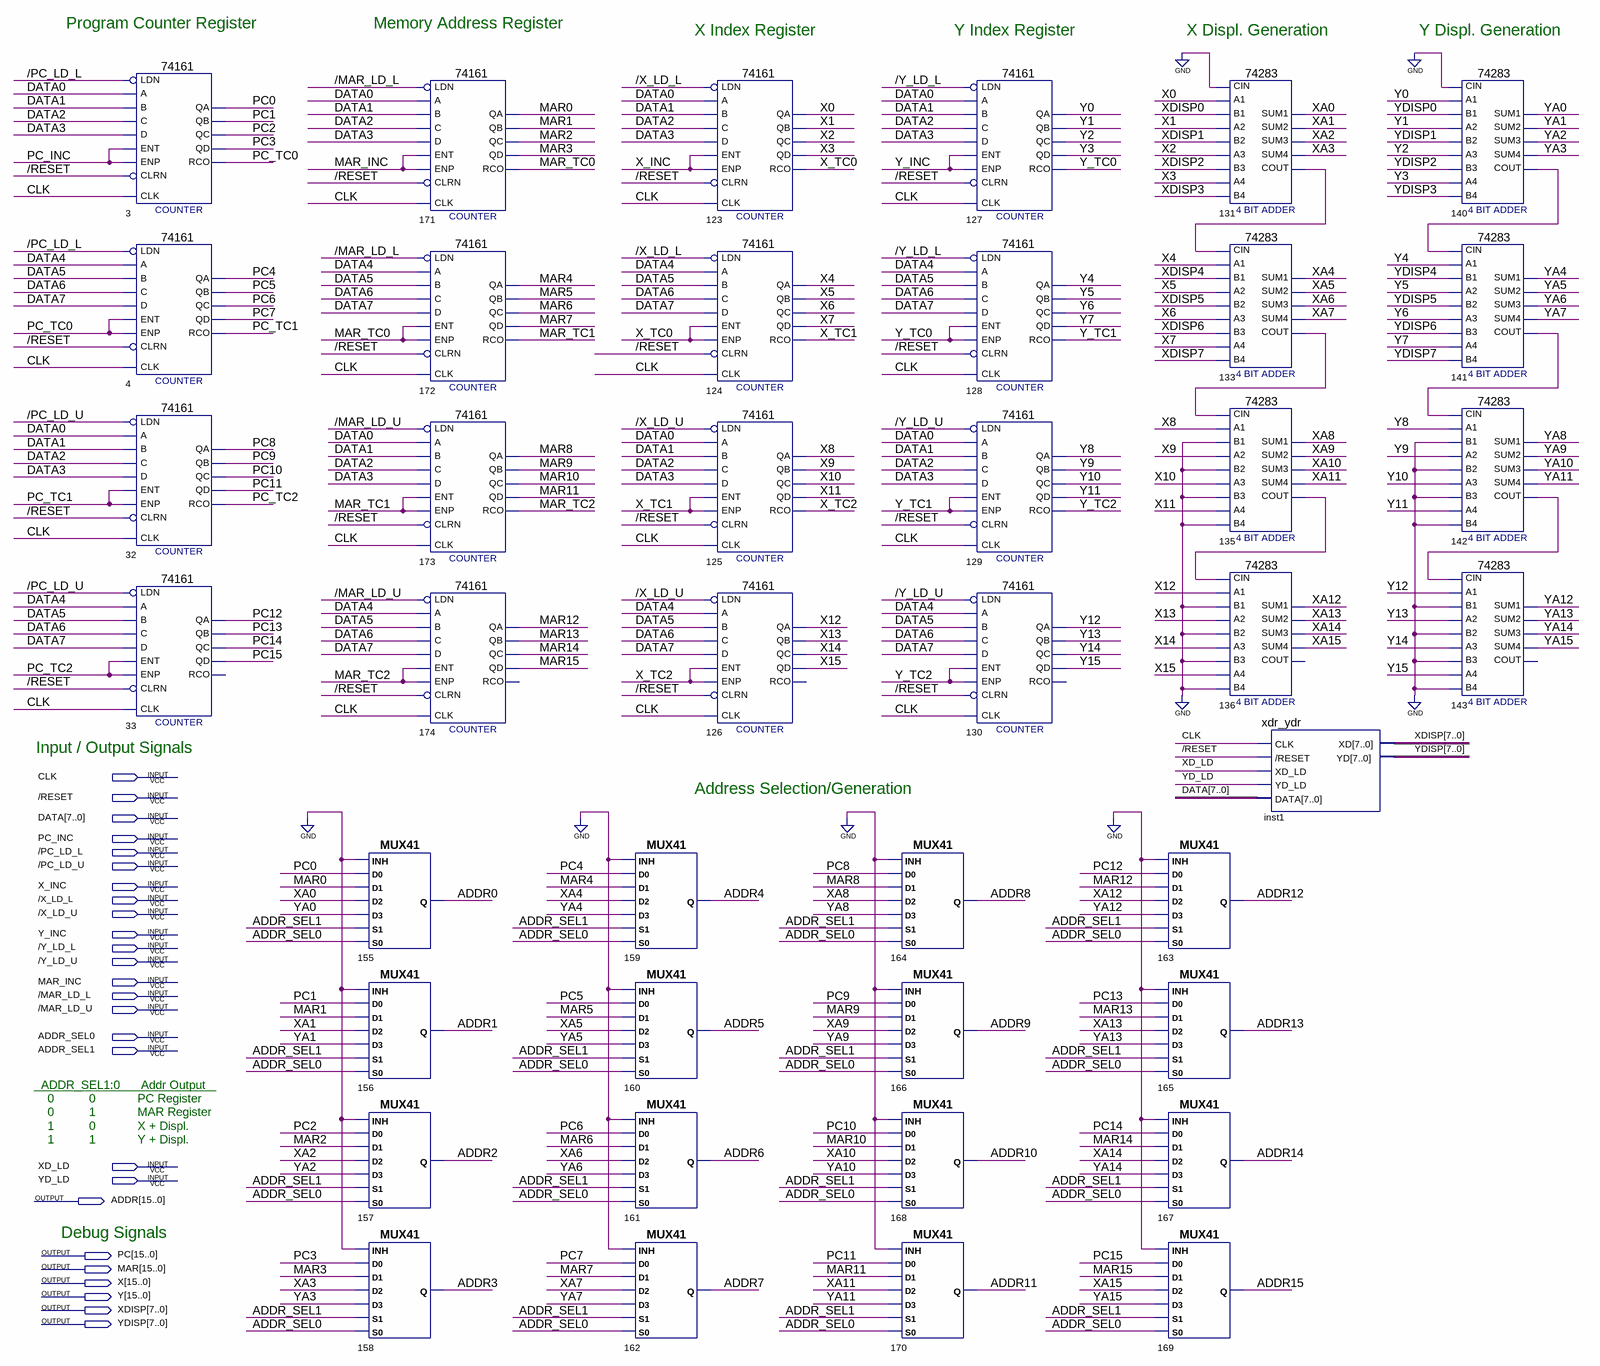
[diagram p0: schematic sheet]
// Quartus schematic pc_mar_ix.bdf as structural Verilog: 41 symbols, 26 pins
module pc_mar_ix (
  input  CLK,
  input  \/RESET ,
  input  [7:0] DATA,
  input  PC_INC,
  input  \/PC_LD_L ,
  input  \/PC_LD_U ,
  input  X_INC,
  input  \/X_LD_L ,
  input  \/X_LD_U ,
  input  Y_INC,
  input  \/Y_LD_L ,
  input  \/Y_LD_U ,
  input  MAR_INC,
  input  \/MAR_LD_L ,
  input  \/MAR_LD_U ,
  input  ADDR_SEL0,
  input  ADDR_SEL1,
  input  XD_LD,
  input  YD_LD,
  output [15:0] ADDR,
  output [15:0] PC,
  output [15:0] MAR,
  output [15:0] X,
  output [15:0] Y,
  output [7:0] XDISP,
  output [7:0] YDISP
);

  wire MAR_TC0, MAR_TC1, MAR_TC2, n131_cout, n133_cout, n135_cout, n140_cout, n141_cout, n142_cout, PC_TC0,
       PC_TC1, PC_TC2, X_TC0, X_TC1, X_TC2, XA0, XA1, XA2, XA3, XA4, XA5, XA6, XA7, XA8, XA9, XA10, XA11,
       XA12, XA13, XA14, XA15, Y_TC0, Y_TC1, Y_TC2, YA0, YA1, YA2, YA3, YA4, YA5, YA6, YA7, YA8, YA9, YA10,
       YA11, YA12, YA13, YA14, YA15;

  \74161  u_3 (
    .CLRN(\/RESET ), .CLK(CLK), .ENP(PC_INC), .LDN(\/PC_LD_L ), .A(DATA[0]), .D(DATA[3]), .ENT(PC_INC),
    .B(DATA[1]), .C(DATA[2]), .QD(PC[3]), .QC(PC[2]), .QB(PC[1]), .QA(PC[0]), .RCO(PC_TC0));
  \74161  u_4 (
    .CLRN(\/RESET ), .CLK(CLK), .ENP(PC_TC0), .LDN(\/PC_LD_L ), .A(DATA[4]), .D(DATA[7]), .ENT(PC_TC0),
    .B(DATA[5]), .C(DATA[6]), .QD(PC[7]), .QC(PC[6]), .QB(PC[5]), .QA(PC[4]), .RCO(PC_TC1));
  \74161  u_32 (
    .CLRN(\/RESET ), .CLK(CLK), .ENP(PC_TC1), .LDN(\/PC_LD_U ), .A(DATA[0]), .D(DATA[3]), .ENT(PC_TC1),
    .B(DATA[1]), .C(DATA[2]), .QD(PC[11]), .QC(PC[10]), .QB(PC[9]), .QA(PC[8]), .RCO(PC_TC2));
  \74161  u_33 (
    .CLRN(\/RESET ), .CLK(CLK), .ENP(PC_TC2), .LDN(\/PC_LD_U ), .A(DATA[4]), .D(DATA[7]), .ENT(PC_TC2),
    .B(DATA[5]), .C(DATA[6]), .QD(PC[15]), .QC(PC[14]), .QB(PC[13]), .QA(PC[12]));  // open: RCO
  MUX41 u_155 (.S0(ADDR_SEL0), .D2(XA0), .S1(ADDR_SEL1), .D3(YA0), .D0(PC[0]), .INH(1'b0), .D1(MAR[0]), .Q(ADDR[0]));
  MUX41 u_156 (.S0(ADDR_SEL0), .D2(XA1), .S1(ADDR_SEL1), .D3(YA1), .D0(PC[1]), .INH(1'b0), .D1(MAR[1]), .Q(ADDR[1]));
  MUX41 u_157 (.S0(ADDR_SEL0), .D2(XA2), .S1(ADDR_SEL1), .D3(YA2), .D0(PC[2]), .INH(1'b0), .D1(MAR[2]), .Q(ADDR[2]));
  MUX41 u_158 (.S0(ADDR_SEL0), .D2(XA3), .S1(ADDR_SEL1), .D3(YA3), .D0(PC[3]), .INH(1'b0), .D1(MAR[3]), .Q(ADDR[3]));
  \74161  u_171 (
    .CLRN(\/RESET ), .CLK(CLK), .ENP(MAR_INC), .LDN(\/MAR_LD_L ), .A(DATA[0]), .D(DATA[3]), .ENT(MAR_INC),
    .B(DATA[1]), .C(DATA[2]), .QD(MAR[3]), .QC(MAR[2]), .QB(MAR[1]), .QA(MAR[0]), .RCO(MAR_TC0));
  \74161  u_172 (
    .CLRN(\/RESET ), .CLK(CLK), .ENP(MAR_TC0), .LDN(\/MAR_LD_L ), .A(DATA[4]), .D(DATA[7]), .ENT(MAR_TC0),
    .B(DATA[5]), .C(DATA[6]), .QD(MAR[7]), .QC(MAR[6]), .QB(MAR[5]), .QA(MAR[4]), .RCO(MAR_TC1));
  \74161  u_173 (
    .CLRN(\/RESET ), .CLK(CLK), .ENP(MAR_TC1), .LDN(\/MAR_LD_U ), .A(DATA[0]), .D(DATA[3]), .ENT(MAR_TC1),
    .B(DATA[1]), .C(DATA[2]), .QD(MAR[11]), .QC(MAR[10]), .QB(MAR[9]), .QA(MAR[8]), .RCO(MAR_TC2));
  \74161  u_174 (
    .CLRN(\/RESET ), .CLK(CLK), .ENP(MAR_TC2), .LDN(\/MAR_LD_U ), .A(DATA[4]), .D(DATA[7]), .ENT(MAR_TC2),
    .B(DATA[5]), .C(DATA[6]), .QD(MAR[15]), .QC(MAR[14]), .QB(MAR[13]), .QA(MAR[12]));  // open: RCO
  MUX41 u_159 (.S0(ADDR_SEL0), .D2(XA4), .S1(ADDR_SEL1), .D3(YA4), .D0(PC[4]), .INH(1'b0), .D1(MAR[4]), .Q(ADDR[4]));
  MUX41 u_160 (.S0(ADDR_SEL0), .D2(XA5), .S1(ADDR_SEL1), .D3(YA5), .D0(PC[5]), .INH(1'b0), .D1(MAR[5]), .Q(ADDR[5]));
  MUX41 u_161 (.S0(ADDR_SEL0), .D2(XA6), .S1(ADDR_SEL1), .D3(YA6), .D0(PC[6]), .INH(1'b0), .D1(MAR[6]), .Q(ADDR[6]));
  MUX41 u_162 (.S0(ADDR_SEL0), .D2(XA7), .S1(ADDR_SEL1), .D3(YA7), .D0(PC[7]), .INH(1'b0), .D1(MAR[7]), .Q(ADDR[7]));
  \74161  u_123 (
    .CLRN(\/RESET ), .CLK(CLK), .ENP(X_INC), .LDN(\/X_LD_L ), .A(DATA[0]), .D(DATA[3]), .ENT(X_INC),
    .B(DATA[1]), .C(DATA[2]), .QD(X[3]), .QC(X[2]), .QB(X[1]), .QA(X[0]), .RCO(X_TC0));
  \74161  u_124 (
    .CLRN(\/RESET ), .CLK(CLK), .ENP(X_TC0), .LDN(\/X_LD_L ), .A(DATA[4]), .D(DATA[7]), .ENT(X_TC0),
    .B(DATA[5]), .C(DATA[6]), .QD(X[7]), .QC(X[6]), .QB(X[5]), .QA(X[4]), .RCO(X_TC1));
  \74161  u_125 (
    .CLRN(\/RESET ), .CLK(CLK), .ENP(X_TC1), .LDN(\/X_LD_U ), .A(DATA[0]), .D(DATA[3]), .ENT(X_TC1),
    .B(DATA[1]), .C(DATA[2]), .QD(X[11]), .QC(X[10]), .QB(X[9]), .QA(X[8]), .RCO(X_TC2));
  \74161  u_126 (
    .CLRN(\/RESET ), .CLK(CLK), .ENP(X_TC2), .LDN(\/X_LD_U ), .A(DATA[4]), .D(DATA[7]), .ENT(X_TC2),
    .B(DATA[5]), .C(DATA[6]), .QD(X[15]), .QC(X[14]), .QB(X[13]), .QA(X[12]));  // open: RCO
  MUX41 u_164 (.S0(ADDR_SEL0), .D2(XA8), .S1(ADDR_SEL1), .D3(YA8), .D0(PC[8]), .INH(1'b0), .D1(MAR[8]), .Q(ADDR[8]));
  MUX41 u_166 (.S0(ADDR_SEL0), .D2(XA9), .S1(ADDR_SEL1), .D3(YA9), .D0(PC[9]), .INH(1'b0), .D1(MAR[9]), .Q(ADDR[9]));
  MUX41 u_168 (
    .S0(ADDR_SEL0), .D2(XA10), .S1(ADDR_SEL1), .D3(YA10), .D0(PC[10]), .INH(1'b0), .D1(MAR[10]), .Q(ADDR[10]));
  MUX41 u_170 (
    .S0(ADDR_SEL0), .D2(XA11), .S1(ADDR_SEL1), .D3(YA11), .D0(PC[11]), .INH(1'b0), .D1(MAR[11]), .Q(ADDR[11]));
  \74161  u_127 (
    .CLRN(\/RESET ), .CLK(CLK), .ENP(Y_INC), .LDN(\/Y_LD_L ), .A(DATA[0]), .D(DATA[3]), .ENT(Y_INC),
    .B(DATA[1]), .C(DATA[2]), .QD(Y[3]), .QC(Y[2]), .QB(Y[1]), .QA(Y[0]), .RCO(Y_TC0));
  \74161  u_128 (
    .CLRN(\/RESET ), .CLK(CLK), .ENP(Y_TC0), .LDN(\/Y_LD_L ), .A(DATA[4]), .D(DATA[7]), .ENT(Y_TC0),
    .B(DATA[5]), .C(DATA[6]), .QD(Y[7]), .QC(Y[6]), .QB(Y[5]), .QA(Y[4]), .RCO(Y_TC1));
  \74161  u_129 (
    .CLRN(\/RESET ), .CLK(CLK), .ENP(Y_TC1), .LDN(\/Y_LD_U ), .A(DATA[0]), .D(DATA[3]), .ENT(Y_TC1),
    .B(DATA[1]), .C(DATA[2]), .QD(Y[11]), .QC(Y[10]), .QB(Y[9]), .QA(Y[8]), .RCO(Y_TC2));
  \74161  u_130 (
    .CLRN(\/RESET ), .CLK(CLK), .ENP(Y_TC2), .LDN(\/Y_LD_U ), .A(DATA[4]), .D(DATA[7]), .ENT(Y_TC2),
    .B(DATA[5]), .C(DATA[6]), .QD(Y[15]), .QC(Y[14]), .QB(Y[13]), .QA(Y[12]));  // open: RCO
  MUX41 u_163 (
    .S0(ADDR_SEL0), .D2(XA12), .S1(ADDR_SEL1), .D3(YA12), .D0(PC[12]), .INH(1'b0), .D1(MAR[12]), .Q(ADDR[12]));
  MUX41 u_165 (
    .S0(ADDR_SEL0), .D2(XA13), .S1(ADDR_SEL1), .D3(YA13), .D0(PC[13]), .INH(1'b0), .D1(MAR[13]), .Q(ADDR[13]));
  MUX41 u_167 (
    .S0(ADDR_SEL0), .D2(XA14), .S1(ADDR_SEL1), .D3(YA14), .D0(PC[14]), .INH(1'b0), .D1(MAR[14]), .Q(ADDR[14]));
  MUX41 u_169 (
    .S0(ADDR_SEL0), .D2(XA15), .S1(ADDR_SEL1), .D3(YA15), .D0(PC[15]), .INH(1'b0), .D1(MAR[15]), .Q(ADDR[15]));
  \74283  u_131 (
    .CIN(1'b0), .A1(X[0]), .A2(X[1]), .B2(XDISP[1]), .A3(X[2]), .A4(X[3]), .B4(XDISP[3]), .B1(XDISP[0]),
    .B3(XDISP[2]), .SUM4(XA3), .COUT(n131_cout), .SUM1(XA0), .SUM2(XA1), .SUM3(XA2));
  \74283  u_133 (
    .CIN(n131_cout), .A1(X[4]), .A2(X[5]), .B2(XDISP[5]), .A3(X[6]), .A4(X[7]), .B4(XDISP[7]), .B1(XDISP[4]),
    .B3(XDISP[6]), .SUM4(XA7), .COUT(n133_cout), .SUM1(XA4), .SUM2(XA5), .SUM3(XA6));
  \74283  u_135 (
    .CIN(n133_cout), .A1(X[8]), .A2(X[9]), .B2(1'b0), .A3(X[10]), .A4(X[11]), .B4(1'b0), .B1(1'b0),
    .B3(1'b0), .SUM4(XA11), .COUT(n135_cout), .SUM1(XA8), .SUM2(XA9), .SUM3(XA10));
  \74283  u_136 (
    .CIN(n135_cout), .A1(X[12]), .A2(X[13]), .B2(1'b0), .A3(X[14]), .A4(X[15]), .B4(1'b0), .B1(1'b0),
    .B3(1'b0), .SUM4(XA15), .SUM1(XA12), .SUM2(XA13), .SUM3(XA14));  // open: COUT
  xdr_ydr inst1 (.CLK(CLK), .\/RESET (\/RESET ), .XD_LD(XD_LD), .YD_LD(YD_LD), .DATA(DATA), .XD(XDISP), .YD(YDISP));
  \74283  u_140 (
    .CIN(1'b0), .A1(Y[0]), .A2(Y[1]), .B2(YDISP[1]), .A3(Y[2]), .A4(Y[3]), .B4(YDISP[3]), .B1(YDISP[0]),
    .B3(YDISP[2]), .SUM4(YA3), .COUT(n140_cout), .SUM1(YA0), .SUM2(YA1), .SUM3(YA2));
  \74283  u_141 (
    .CIN(n140_cout), .A1(Y[4]), .A2(Y[5]), .B2(YDISP[5]), .A3(Y[6]), .A4(Y[7]), .B4(YDISP[7]), .B1(YDISP[4]),
    .B3(YDISP[6]), .SUM4(YA7), .COUT(n141_cout), .SUM1(YA4), .SUM2(YA5), .SUM3(YA6));
  \74283  u_142 (
    .CIN(n141_cout), .A1(Y[8]), .A2(Y[9]), .B2(1'b0), .A3(Y[10]), .A4(Y[11]), .B4(1'b0), .B1(1'b0),
    .B3(1'b0), .SUM4(YA11), .COUT(n142_cout), .SUM1(YA8), .SUM2(YA9), .SUM3(YA10));
  \74283  u_143 (
    .CIN(n142_cout), .A1(Y[12]), .A2(Y[13]), .B2(1'b0), .A3(Y[14]), .A4(Y[15]), .B4(1'b0), .B1(1'b0),
    .B3(1'b0), .SUM4(YA15), .SUM1(YA12), .SUM2(YA13), .SUM3(YA14));  // open: COUT

  // Notes on the sheet:
  //    Program Counter Register 
  //    Memory Address Register
  //    X Index Register
  //    Y Index Register
  //    X Displ. Generation
  //    Y Displ. Generation
  //     Input / Output Signals
  //    Address Selection/Generation
  //   ____________________________
  //   ADDR_SEL1:0      Addr Output
  //   0          0            PC Register
  //   0          1            MAR Register
  //   1          0            X + Displ.
  //   1          1            Y + Displ.
  //      Debug Signals
endmodule
